# Altium project praline.PrjPcb (part 2 of 3)

## Sheet adc-dac.SchDoc
size 297 x 209 mm
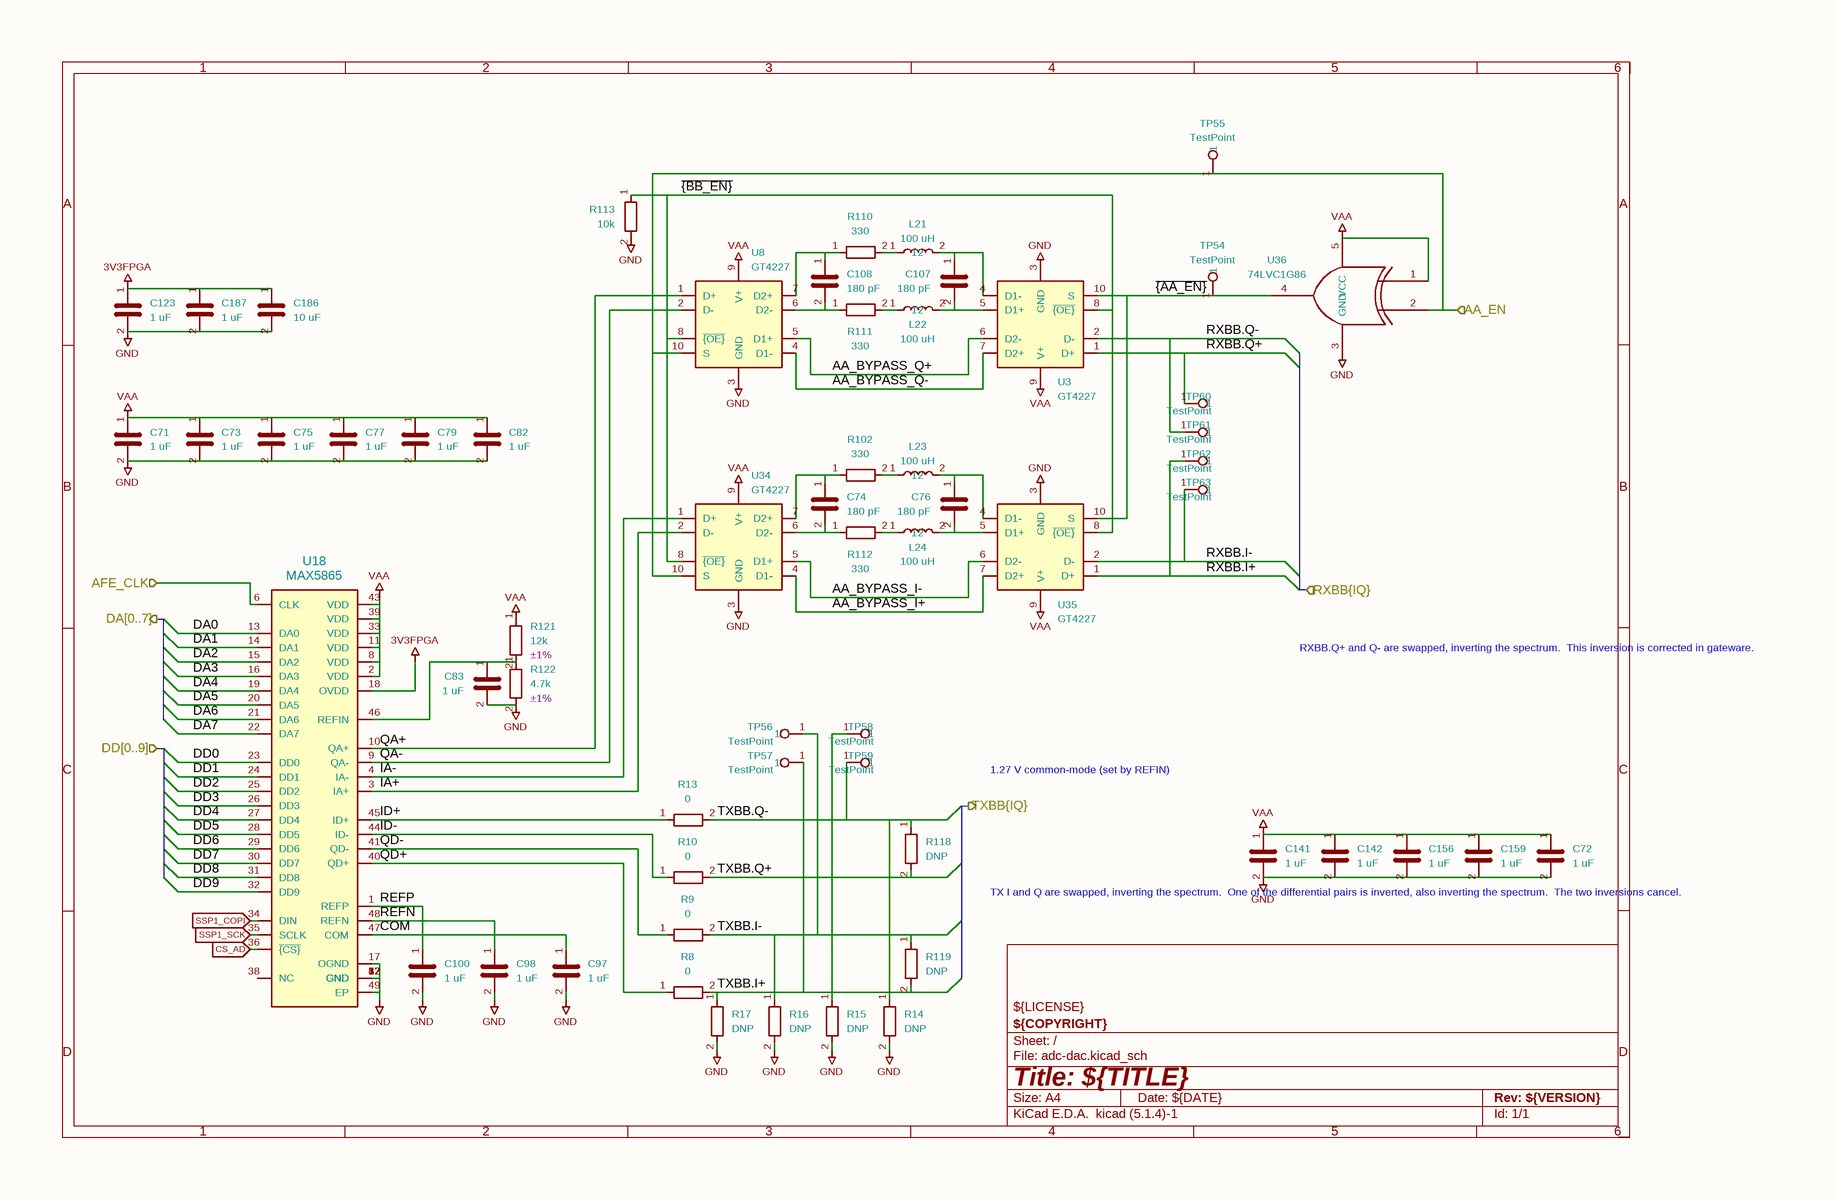
[diagram p5: adc-dac.SchDoc]

### Parts
C71  1 uF  [C_0201_0603Metric]
C72  1 uF  [C_0201_0603Metric]
C73  1 uF  [C_0201_0603Metric]
C74  180 pF  [C_0201_0603Metric]
C75  1 uF  [C_0201_0603Metric]
C76  180 pF  [C_0201_0603Metric]
C77  1 uF  [C_0201_0603Metric]
C79  1 uF  [C_0201_0603Metric]
C82  1 uF  [C_0201_0603Metric]
C83  1 uF  [C_0201_0603Metric]
C97  1 uF  [C_0201_0603Metric]
C98  1 uF  [C_0201_0603Metric]
C100  1 uF  [C_0201_0603Metric]
C107  180 pF  [C_0201_0603Metric]
C108  180 pF  [C_0201_0603Metric]
C123  1 uF  [C_0201_0603Metric]
C141  1 uF  [C_0201_0603Metric]
C142  1 uF  [C_0201_0603Metric]
C156  1 uF  [C_0201_0603Metric]
C159  1 uF  [C_0201_0603Metric]
C186  10 uF  [C_0805_2012Metric]
C187  1 uF  [C_0201_0603Metric]
L21  100 uH  [L_TDK_MLZ2012_h1.25mm]
L22  100 uH  [L_TDK_MLZ2012_h1.25mm]
L23  100 uH  [L_TDK_MLZ2012_h1.25mm]
L24  100 uH  [L_TDK_MLZ2012_h1.25mm]
R8  0  [R_0201_0603Metric]
R9  0  [R_0201_0603Metric]
R10  0  [R_0201_0603Metric]
R13  0  [R_0201_0603Metric]
R14  DNP  [R_0201_0603Metric]
R15  DNP  [R_0201_0603Metric]
R16  DNP  [R_0201_0603Metric]
R17  DNP  [R_0201_0603Metric]
R102  330  [R_0201_0603Metric]
R110  330  [R_0201_0603Metric]
R111  330  [R_0201_0603Metric]
R112  330  [R_0201_0603Metric]
R113  10k  [R_0402_1005Metric]
R118  DNP  [R_0201_0603Metric]
R119  DNP  [R_0201_0603Metric]
R121  Tolerance: ±1%  [R_0201_0603Metric]  (hidden comment: 12k)
R122  Tolerance: ±1%  [R_0201_0603Metric]  (hidden comment: 4.7k)
TP54  TestPoint  [TestPoint_Pad_D1.0mm]
TP55  TestPoint  [TestPoint_Pad_D1.0mm]
TP56  TestPoint  [TestPoint_Pad_D1.0mm]
TP57  TestPoint  [TestPoint_Pad_D1.0mm]
TP58  TestPoint  [TestPoint_Pad_D1.0mm]
TP59  TestPoint  [TestPoint_Pad_D1.0mm]
TP60  TestPoint  [TestPoint_Pad_D1.0mm]
TP61  TestPoint  [TestPoint_Pad_D1.0mm]
TP62  TestPoint  [TestPoint_Pad_D1.0mm]
TP63  TestPoint  [TestPoint_Pad_D1.0mm]
U3  GT4227  [GTIC_UQFN-10_1.4x1.8mm_P0.4mm]
U8  GT4227  [GTIC_UQFN-10_1.4x1.8mm_P0.4mm]
U18  MAX5865  [QFN-48-1EP_7x7mm_P0.5mm_EP5.3x5.3mm_ThermalVias]
U34  GT4227  [GTIC_UQFN-10_1.4x1.8mm_P0.4mm]
U35  GT4227  [GTIC_UQFN-10_1.4x1.8mm_P0.4mm]
U36  74LVC1G86  [SOT-353_SC-70-5]

### Ports
AA_EN (in), AFE_CLK (in), CS_AD (in), DA[0..7] (out), DD[0..9] (in), RXBB{IQ} (in), SSP1_COPI (in), SSP1_SCK (in), TXBB{IQ} (out)

### Nets
3V3FPGA: C123.1 C186.1 C187.1 U18.18(OVDD)
GND: C71.2 C72.2 C73.2 C75.2 C77.2 C79.2 C82.2 C83.2 C97.2 C98.2 C100.2 C123.2 C141.2 C142.2 C156.2 C159.2 C186.2 C187.2 R14.2 R15.2 R16.2 R17.2 R113.2 R122.2 U3.3(GND) U8.3(GND) U18.5(GND) U18.7(GND) U18.12(GND) U18.17(OGND) U18.37(GND) U18.42(GND) U18.49(EP) U34.3(GND) U35.3(GND) U36.3(GND)
VAA: C71.1 C72.1 C73.1 C75.1 C77.1 C79.1 C82.1 C141.1 C142.1 C156.1 C159.1 R121.1 U3.9(V+) U8.9(V+) U18.2(VDD) U18.8(VDD) U18.11(VDD) U18.33(VDD) U18.39(VDD) U18.43(VDD) U34.9(V+) U35.9(V+) U36.1 U36.5(VCC)
AA_BYPASS_I+: U34.4(D1-) U35.7(D2+)
AA_BYPASS_I-: U34.5(D1+) U35.6(D2-)
AA_BYPASS_Q+: U3.6(D2-) U8.5(D1+)
AA_BYPASS_Q-: U3.7(D2+) U8.4(D1-)
AA_EN: TP55.1 U8.10(S) U34.10(S) U36.2 ; port AA_EN
AFE_CLK: U18.6(CLK) ; port AFE_CLK
COM: C97.1 U18.47(COM)
CS_AD: U18.36(~{{CS}}) ; port CS_AD
DA0: U18.13(DA0)
DA1: U18.14(DA1)
DA2: U18.15(DA2)
DA3: U18.16(DA3)
DA4: U18.19(DA4)
DA5: U18.20(DA5)
DA6: U18.21(DA6)
DA7: U18.22(DA7)
DD0: U18.23(DD0)
DD1: U18.24(DD1)
DD2: U18.25(DD2)
DD3: U18.26(DD3)
DD4: U18.27(DD4)
DD5: U18.28(DD5)
DD6: U18.29(DD6)
DD7: U18.30(DD7)
DD8: U18.31(DD8)
DD9: U18.32(DD9)
IA+: U18.3(IA+) U34.2(D-)
IA-: U18.4(IA-) U34.1(D+)
ID+: R13.1 U18.45(ID+)
ID-: R10.1 U18.44(ID-)
QA+: U8.1(D+) U18.10(QA+)
QA-: U8.2(D-) U18.9(QA-)
QD+: R8.1 U18.40(QD+)
QD-: R9.1 U18.41(QD-)
REFN: C98.1 U18.48(REFN)
REFP: C100.1 U18.1(REFP)
RXBB.I+: TP62.1 U35.1(D+)
RXBB.I-: TP63.1 U35.2(D-)
RXBB.Q+: TP60.1 U3.1(D+)
RXBB.Q-: TP61.1 U3.2(D-)
SSP1_COPI: U18.34(DIN) ; port SSP1_COPI
SSP1_SCK: U18.35(SCLK) ; port SSP1_SCK
TXBB.I+: R8.2 R17.1 R119.2 TP57.1
TXBB.I-: R9.2 R16.1 R119.1 TP56.1
TXBB.Q+: R10.2 R15.1 R118.2 TP58.1
TXBB.Q-: R13.2 R14.1 R118.1 TP59.1
~{{AA_EN}}: TP54.1 U3.10(S) U35.10(S) U36.4
~{{BB_EN}}: R113.1 U3.8(~{{OE}}) U8.8(~{{OE}}) U34.8(~{{OE}}) U35.8(~{{OE}})
NetC74_1: C74.1 R102.1 U34.7(D2+)
NetC74_2: C74.2 R112.1 U34.6(D2-)
NetC76_1: C76.1 L23.2 U35.4(D1-)
NetC76_2: C76.2 L24.2 U35.5(D1+)
NetC83_1: C83.1 R121.2 R122.1 U18.46(REFIN)
NetC107_1: C107.1 L21.2 U3.4(D1-)
NetC107_2: C107.2 L22.2 U3.5(D1+)
NetC108_1: C108.1 R110.1 U8.7(D2+)
NetC108_2: C108.2 R111.1 U8.6(D2-)
NetL21_1: L21.1 R110.2
NetL22_1: L22.1 R111.2
NetL23_1: L23.1 R102.2
NetL24_1: L24.1 R112.2

Not connected (* = marked no-connect by the designer): U18 38(NC)

### Notes on the sheet
- RXBB.Q+ and Q- are swapped, inverting
  the spectrum.  This inversion is
  corrected in gateware.
- 1.27 V common-mode
  (set by REFIN)
- TX I and Q are swapped, inverting the
  spectrum.  One of the differential pairs
  is inverted, also inverting the
  spectrum.  The two inversions cancel.
- 1
- 2
- 3
- 4
- 5
- 6
- A
- B
- C
- ${LICENSE}
- D
- Title: ${TITLE}
- File: adc-dac.kicad_sch
- Sheet: /
- ${COPYRIGHT}
- KiCad E.D.A.  kicad (5.1.4)-1
- Size: A4
- Date: ${DATE}
- Rev: ${VERSION}
- Id: 1/1

### Library data of the parts
C71-C73 C75 C77 C79 C82 C83 C97 C98 C100 C123 C141 C142 C156 C159 C187 = C: as C17 on sheet baseband; Value: 1 uF; Footprint: Capacitor_SMD:C_0201_0603Metric
C74 C76 C107 C108 = C: Manufacturer: Murata; Part Number: GRM0335C1H181JA01D; Description: CAP CER 180PF 50V C0G/NP0 0201; Substitution: GRM0335C1H181*; Value: 180 pF; Footprint: Capacitor_SMD:C_0201_0603Metric
C186 = C: as C200 on sheet frontend; Value: 10 uF; Footprint: Capacitor_SMD:C_0805_2012Metric
L21-L24 = L: as L4 on sheet frontend; Value: 100 uH; Footprint: praline:L_TDK_MLZ2012_h1.25mm
R8-R10 R13 = R: as R149 on sheet baseband; Value: 0; Footprint: Resistor_SMD:R_0201_0603Metric
R14-R17 R118 R119 = R: Value: DNP; Footprint: Resistor_SMD:R_0201_0603Metric
R102 R110-R112 = R: Manufacturer: Yageo; Part Number: RC0201JR-07330RL; Description: RES 330 OHM 5% 1/20W 0201; Substitution: any equivalent; Value: 330; Footprint: Resistor_SMD:R_0201_0603Metric
R113 = R: as R7 on sheet mcu; Value: 10k; Footprint: Resistor_SMD:R_0402_1005Metric
R121 = R: Manufacturer: Yageo; Part Number: RC0201FR-0712KL; Description: RES 12K OHM 1% 1/20W 0201; Substitution: any equivalent; Value: 12k; Footprint: Resistor_SMD:R_0201_0603Metric
R122 = R: as R74 on sheet mcu; Value: 4.7k; Footprint: Resistor_SMD:R_0201_0603Metric
U3 U8 U34 U35 = GT4227QA: Manufacturer: GTIC; Description: USB 2.0 Switch with ESD Protection, UQFN-10 Pitch 0.4 mm; Part Number: GT4227QA; Value: GT4227; Footprint: praline:GTIC_UQFN-10_1.4x1.8mm_P0.4mm
U18 = MAX5864: Manufacturer: Maxim; Part Number: MAX5865ETM+T; Description: IC ANLG FRONT END 40MSPS 48-TQFN; Substitution: MAX5865ETM+; Value: MAX5865; Footprint: praline:QFN-48-1EP_7x7mm_P0.5mm_EP5.3x5.3mm_ThermalVias
U36 = 74LVC1G86: as U13 on sheet frontend; Value: 74LVC1G86; Footprint: Package_TO_SOT_SMD:SOT-353_SC-70-5
TP54-TP63 = TestPoint: Value: TestPoint; Footprint: TestPoint:TestPoint_Pad_D1.0mm

## Sheet power.SchDoc
size 297 x 209 mm
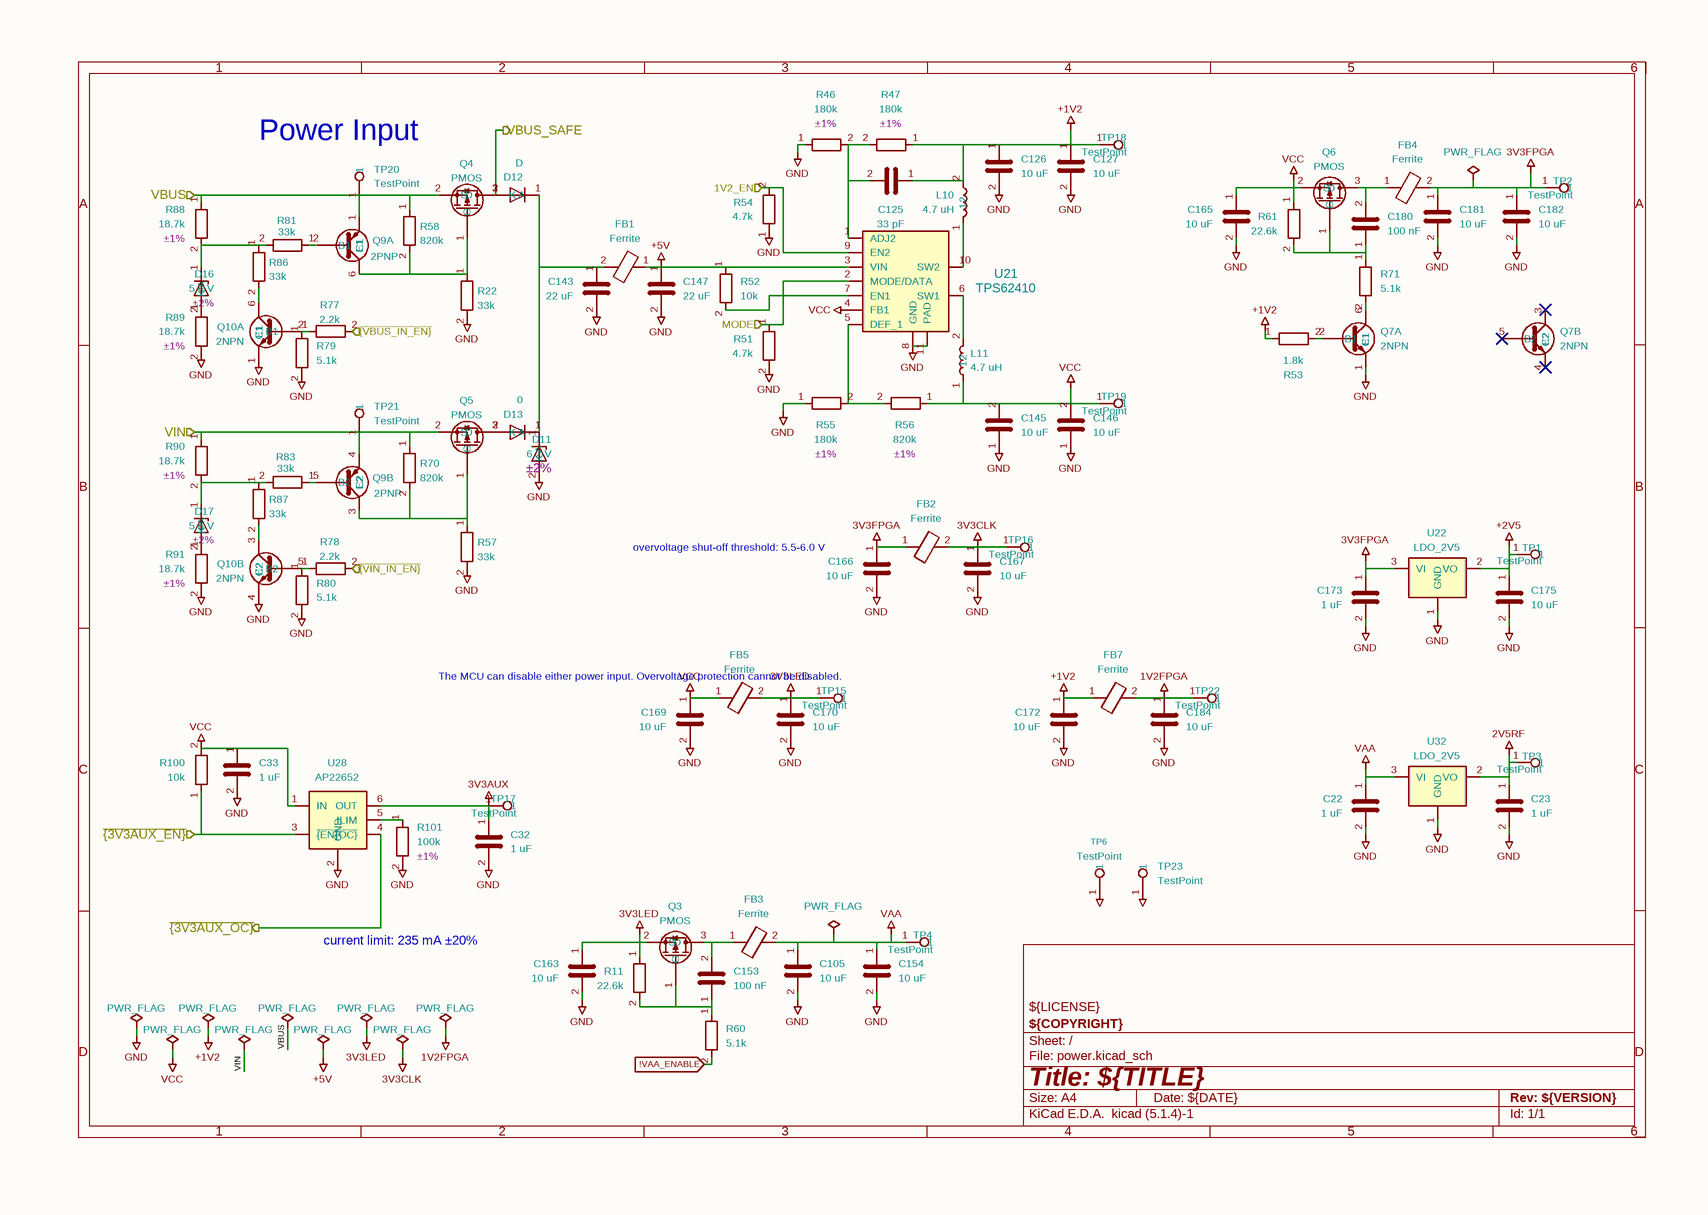
[diagram p6: power.SchDoc]

### Parts
#FLG01  PWR_FLAG  (graphical)
#FLG02  PWR_FLAG  (graphical)
#FLG03  PWR_FLAG  (graphical)
#FLG04  PWR_FLAG  (graphical)
#FLG05  PWR_FLAG  (graphical)
#FLG06  PWR_FLAG  (graphical)
#FLG08  PWR_FLAG  (graphical)
#FLG09  PWR_FLAG  (graphical)
#FLG012  PWR_FLAG  (graphical)
#FLG013  PWR_FLAG  (graphical)
#FLG014  PWR_FLAG  (graphical)
C22  1 uF  [C_0402_1005Metric]
C23  1 uF  [C_0402_1005Metric]
C32  1 uF  [C_0402_1005Metric]
C33  1 uF  [C_0402_1005Metric]
C105  10 uF  [C_0805_2012Metric]
C125  33 pF  [C_0201_0603Metric]
C126  10 uF  [C_0805_2012Metric]
C127  10 uF  [C_0805_2012Metric]
C143  22 uF  [C_0805_2012Metric]
C145  10 uF  [C_0805_2012Metric]
C146  10 uF  [C_0805_2012Metric]
C147  22 uF  [C_0805_2012Metric]
C153  100 nF  [C_0402_1005Metric]
C154  10 uF  [C_0805_2012Metric]
C163  10 uF  [C_0805_2012Metric]
C165  10 uF  [C_0805_2012Metric]
C166  10 uF  [C_0805_2012Metric]
C167  10 uF  [C_0805_2012Metric]
C169  10 uF  [C_0805_2012Metric]
C170  10 uF  [C_0805_2012Metric]
C172  10 uF  [C_0805_2012Metric]
C173  1 uF  [C_0402_1005Metric]
C175  10 uF  [C_0805_2012Metric]
C180  100 nF  [C_0402_1005Metric]
C181  10 uF  [C_0805_2012Metric]
C182  10 uF  [C_0805_2012Metric]
C184  10 uF  [C_0805_2012Metric]
D11  Tolerance: ±2%  [TSLP-2-19]  (hidden comment: 6.2 V)
D12  D  [D_SOD-123FL]
D13  0  [TSLP-2-19]
D16  Tolerance: ±2%  [TSLP-2-19]  (hidden comment: 5.6 V)
D17  Tolerance: ±2%  [TSLP-2-19]  (hidden comment: 5.6 V)
FB1  Ferrite  [L_0603_1608Metric]
FB2  Ferrite  [L_0603_1608Metric]
FB3  Ferrite  [L_0603_1608Metric]
FB4  Ferrite  [L_0603_1608Metric]
FB5  Ferrite  [L_0603_1608Metric]
FB7  Ferrite  [L_0603_1608Metric]
L10  4.7 uH  [L_Taiyo-Yuden_NR-40xx]
L11  4.7 uH  [L_Taiyo-Yuden_NR-40xx]
Q3  PMOS  [SOT-23-3]
Q4  PMOS  [SOT-23-3]
Q5  PMOS  [SOT-23-3]
Q6  PMOS  [SOT-23-3]
Q7  2NPN  [SOT-363_SC-70-6]  (parts A,B of 2)
Q9  2PNP  [SOT-363_SC-70-6]  (parts A,B of 2)
Q10  2NPN  [SOT-363_SC-70-6]  (parts A,B of 2)
R11  22.6k  [R_0201_0603Metric]
R22  33k  [R_0201_0603Metric]
R46  Tolerance: ±1%  [R_0402_1005Metric]  (hidden comment: 180k)
R47  Tolerance: ±1%  [R_0402_1005Metric]  (hidden comment: 180k)
R51  4.7k  [R_0201_0603Metric]
R52  10k  [R_0402_1005Metric]
R53  1.8k  [R_0402_1005Metric]
R54  4.7k  [R_0201_0603Metric]
R55  Tolerance: ±1%  [R_0402_1005Metric]  (hidden comment: 180k)
R56  Tolerance: ±1%  [R_0402_1005Metric]  (hidden comment: 820k)
R57  33k  [R_0201_0603Metric]
R58  820k  [R_0402_1005Metric]
R60  5.1k  [R_0402_1005Metric]
R61  22.6k  [R_0201_0603Metric]
R70  820k  [R_0402_1005Metric]
R71  5.1k  [R_0402_1005Metric]
R77  2.2k  [R_0201_0603Metric]
R78  2.2k  [R_0201_0603Metric]
R79  5.1k  [R_0402_1005Metric]
R80  5.1k  [R_0402_1005Metric]
R81  33k  [R_0201_0603Metric]
R83  33k  [R_0201_0603Metric]
R86  33k  [R_0201_0603Metric]
R87  33k  [R_0201_0603Metric]
R88  Tolerance: ±1%  [R_0402_1005Metric]  (hidden comment: 18.7k)
R89  Tolerance: ±1%  [R_0402_1005Metric]  (hidden comment: 18.7k)
R90  Tolerance: ±1%  [R_0402_1005Metric]  (hidden comment: 18.7k)
R91  Tolerance: ±1%  [R_0402_1005Metric]  (hidden comment: 18.7k)
R100  10k  [R_0402_1005Metric]
R101  Tolerance: ±1%  [R_0402_1005Metric]  (hidden comment: 100k)
TP1  TestPoint  [TestPoint_Pad_D1.0mm]
TP2  TestPoint  [TestPoint_Pad_D1.0mm]
TP3  TestPoint  [TestPoint_Pad_D1.0mm]
TP4  TestPoint  [TestPoint_Pad_D1.0mm]
TP6  TestPoint  [TestPoint_Loop_D1.80mm_Drill1.0mm_Beaded]
TP15  TestPoint  [TestPoint_Pad_D1.0mm]
TP16  TestPoint  [TestPoint_Pad_D1.0mm]
TP17  TestPoint  [TestPoint_Pad_D1.0mm]
TP18  TestPoint  [TestPoint_Pad_D1.0mm]
TP19  TestPoint  [TestPoint_Pad_D1.0mm]
TP20  TestPoint  [TestPoint_Pad_D1.0mm]
TP21  TestPoint  [TestPoint_Pad_D1.0mm]
TP22  TestPoint  [TestPoint_Pad_D1.0mm]
TP23  TestPoint  [TestPoint_Pad_D1.0mm]
U21  TPS62410  [Texas_S-PVSON-N10_ThermalVias]
U22  LDO_2V5  [SOT-23-3]
U28  AP22652  [TSOP-6_1.65x3.05mm_P0.95mm]
U32  LDO_2V5  [SOT-23-3]

### Ports
1V2_EN (in), !VAA_ENABLE (in), MODE (in), VBUS (in), VBUS_SAFE (out), VIN (in), ~{{3V3AUX_EN}} (in), ~{{3V3AUX_OC}} (out), ~{{VBUS_IN_EN}} (in), ~{{VIN_IN_EN}} (in)

### Nets
1V2FPGA: #FLG012.1 C184.1 FB7.2 TP22.1
2V5RF: C23.1 TP3.1 U32.2(VO)
3V3AUX: C32.1 TP17.1 U28.6(OUT)
3V3CLK: #FLG014.1 C167.1 FB2.2 TP16.1
3V3FPGA: #FLG02.1 C166.1 C173.1 C181.1 C182.1 FB2.1 FB4.2 TP2.1 U22.3(VI)
3V3LED: #FLG013.1 C163.1 C170.1 FB5.2 Q3.2(S) R11.1 TP15.1
+1V2: #FLG05.1 C125.1 C126.1 C127.1 C172.1 FB7.1 L10.2 R47.1 R53.1 TP18.1
+2V5: C175.1 TP1.1 U22.2(VO)
+5V: #FLG09.1 C147.1 FB1.1 R52.1 U21.3(VIN)
GND: #FLG01.1 C22.2 C23.2 C32.2 C33.2 C105.2 C126.2 C127.2 C143.2 C145.1 C146.1 C147.2 C154.2 C163.2 C165.2 C166.2 C167.2 C169.2 C170.2 C172.2 C173.2 C175.2 C181.2 C182.2 C184.2 D11.2(A) Q7.1(E1) Q10.1(E1) Q10.4(E2) R22.2 R46.1 R51.2 R54.1 R55.1 R57.2 R79.2 R80.2 R89.2 R91.2 R101.2 TP6.1 TP23.1 U21.8(GND) U21.11(PAD) U22.1(GND) U28.2(GND) U32.1(GND)
VAA: #FLG03.1 C22.1 C105.1 C154.1 FB3.2 TP4.1 U32.3(VI)
VCC: #FLG04.1 C33.1 C145.2 C146.2 C165.1 C169.1 FB5.1 L11.1 Q6.2(S) R56.1 R61.1 R100.2 TP19.1 U21.4(FB1) U28.1(IN)
1V2_EN: R54.2 U21.9(EN2) ; port 1V2_EN
!VAA_ENABLE: R60.2 ; port !VAA_ENABLE
MODE: R51.1 U21.2(MODE/DATA) ; port MODE
VBUS: Q4.2(S) Q9.1(E1) R58.1 R88.1 TP20.1 ; port VBUS
VBUS: #FLG08.1  [a separate net that carries the same name]
VBUS_SAFE: D12.2(A) Q4.3(D) ; port VBUS_SAFE
VIN: Q5.2(S) Q9.4(E2) R70.1 R90.1 TP21.1 ; port VIN
VIN: #FLG06.1  [a separate net that carries the same name]
~{{3V3AUX_EN}}: R100.1 U28.3(~{{EN}}) ; port ~{{3V3AUX_EN}}
~{{3V3AUX_OC}}: U28.4(~{{OC}}) ; port ~{{3V3AUX_OC}}
~{{VBUS_IN_EN}}: R77.2 ; port ~{{VBUS_IN_EN}}
~{{VIN_IN_EN}}: R78.2 ; port ~{{VIN_IN_EN}}
NetC125_2: C125.2 R46.2 R47.2 U21.1(ADJ2)
NetC143_1: C143.1 D11.1(K) D12.1(K) D13.1(K) FB1.2
NetC153_1: C153.1 Q3.1(G) R11.2 R60.1
NetC153_2: C153.2 FB3.1 Q3.3(D)
NetC180_1: C180.1 Q6.1(G) R61.2 R71.1
NetC180_2: C180.2 FB4.1 Q6.3(D)
NetD13_2: D13.2(A) Q5.3(D)
NetD16_1: D16.1(K) R81.2 R86.1 R88.2
NetD16_2: D16.2(A) R89.1
NetD17_1: D17.1(K) R83.2 R87.1 R90.2
NetD17_2: D17.2(A) R91.1
NetL10_1: L10.1 U21.10(SW2)
NetL11_2: L11.2 U21.6(SW1)
NetQ4_1: Q4.1(G) Q9.6(C1) R22.1 R58.2
NetQ5_1: Q5.1(G) Q9.3(C2) R57.1 R70.2
NetQ7_2: Q7.2(B1) R53.2
NetQ7_6: Q7.6(C1) R71.2
NetQ9_2: Q9.2(B1) R81.1
NetQ9_5: Q9.5(B2) R83.1
NetQ10_2: Q10.2(B1) R77.1 R79.1
NetQ10_3: Q10.3(C2) R87.2
NetQ10_5: Q10.5(B2) R78.1 R80.1
NetQ10_6: Q10.6(C1) R86.2
NetR52_2: R52.2 U21.7(EN1)
NetR55_2: R55.2 R56.2 U21.5(DEF_1)
NetR101_1: R101.1 U28.5(ILIM)

Not connected (* = marked no-connect by the designer): Q7 3(C2)* 4(E2)* 5(B2)*

### Notes on the sheet
- (near TP20) Power Input
- (near C166) overvoltage shut-off
  threshold: 5.5-6.0 V
- The MCU can disable either power input.
  Overvoltage protection cannot be disabled.
- current limit: 235 mA ±20%
- 1
- 2
- 3
- 4
- 5
- 6
- A
- B
- C
- ${LICENSE}
- D
- Title: ${TITLE}
- File: power.kicad_sch
- Sheet: /
- ${COPYRIGHT}
- KiCad E.D.A.  kicad (5.1.4)-1
- Size: A4
- Date: ${DATE}
- Rev: ${VERSION}
- Id: 1/1

### Library data of the parts
#FLG01 #FLG02 #FLG03 #FLG04 #FLG05 #FLG06 #FLG08 #FLG09 #FLG012 #FLG013 #FLG014 = PWR_FLAG: Description: Special symbol for telling ERC where power comes from; Value: PWR_FLAG
C22 C23 C173 = C: Part Number: CL05A105KA5NQNC; Manufacturer: Samsung; Description: CAP CER 1UF 25V X5R 0402; Substitution: Murata GRM155R61E105KA12D; Value: 1 uF; Footprint: Capacitor_SMD:C_0402_1005Metric
C32 C33 = C: Manufacturer: Samsung; Part Number: CL05A105KA5NQNC; Description: CAP CER 1UF 25V X5R 0402; Substitution: Murata GRM155R61E105KA12D; Value: 1 uF; Footprint: Capacitor_SMD:C_0402_1005Metric
C105 C126 C127 C145 C146 C154 C163 C165-C167 C169 C170 C172 C175 C181 C182 C184 = C: Manufacturer: Samsung; Part Number: CL21A106KOQNNNE; Description: CAP CER 10UF 16V X5R 0805; Substitution: Murata GRM21BR61A106KE19L; Value: 10 uF; Footprint: Capacitor_SMD:C_0805_2012Metric
C125 = C: Manufacturer: Murata; Part Number: GRM0335C1H330JA01D; Description: CAP CER 33PF 50V C0G/NP0 0201; Substitution: GRM0335C1H330*, GRM0335C1E330*; Value: 33 pF; Footprint: Capacitor_SMD:C_0201_0603Metric
C143 C147 = C: Manufacturer: Samsung; Part Number: CL21A226MAYNNNE; Description: CAP CER 22UF 25V X5R 0805; Substitution: Murata GRM21BR61A106KE19L; Value: 22 uF; Footprint: Capacitor_SMD:C_0805_2012Metric
C153 C180 = C: Manufacturer: Samsung; Part Number: CL05A104KA5NNNC; Description: CAP CER 0.1UF 25V X5R 0402; Substitution: Murata GRM155R61A104KA01D; Value: 100 nF; Footprint: Capacitor_SMD:C_0402_1005Metric
D11 = D_Zener: Manufacturer: Nexperia; Part Number: BZX884-B6V2,315; Description: DIODE ZENER 6.2V 250MW DFN1006-2; Value: 6.2 V; Footprint: praline:TSLP-2-19
D12 = D: Manufacturer: Yangzhou Yangjie; Part Number: U1D; Description: SOD-123FL 200V 1.0A  Diodes Rec; Value: D; Footprint: praline:D_SOD-123FL
D13 = D: Manufacturer: Yageo; Part Number: RC0201JR-070RL; Description: RES 0 OHM JUMPER 1/20W 0201; Value: 0; Footprint: praline:TSLP-2-19
D16 D17 = D_Zener: Manufacturer: Nexperia; Part Number: BZX884-B5V6,315; Description: DIODE ZENER 5.6V 250MW DFN1006-2; Value: 5.6 V; Footprint: praline:TSLP-2-19
FB1-FB5 FB7 = FerriteBead: Manufacturer: TAI-TECH; Part Number: HCB1608KF-102T10; Description: 1kΩ@100MHz 200mΩ ±25% 0603 Ferrite Bead; Substitution: Murata BLM18KG102SN1*; Value: Ferrite; Footprint: Inductor_SMD:L_0603_1608Metric
L10 L11 = L: Manufacturer: Taiyo Yuden; Part Number: LSXND4040TKL4R7MDG; Description: FIXED IND 4.7UH 1.7A 84 MOHM SMD; Substitution: NRS4018T4R7MDGJ, LLXND4040TKL4R7MDG, NRS4018T4R7MDGJ; Value: 4.7 uH; Footprint: Inductor_SMD:L_Taiyo-Yuden_NR-40xx
Q3-Q6 = Q_PMOS_GSD: Manufacturer: Yangzhou Yangjie; Part Number: YJL3401A; Description: P-CH MOSFET 30V 4.4A SOT-23-3L; Substitution: Alpha & Omega AO3401A; Value: PMOS; Footprint: Package_TO_SOT_SMD:SOT-23-3
Q7 Q10 = BC847BS: Manufacturer: Yangzhou Yangjie; Description: SOT-363 NPN+NPN 0.3W 0.1A 50V; Part Number: BC847BS; Value: 2NPN; Footprint: Package_TO_SOT_SMD:SOT-363_SC-70-6
Q9 = Q_Dual_PNP_PNP_E1B1C2E2B2C1: Manufacturer: Yangzhou Yangjie; Part Number: BC857BS; Description: PNP+PNP TRANS 45V 0.2A SOT-363; Value: 2PNP; Footprint: Package_TO_SOT_SMD:SOT-363_SC-70-6
R11 R61 = R: Manufacturer: Yageo; Part Number: RC0201FR-0722K6L; Description: RES 22.6K OHM 1% 1/20W 0201; Substitution: any equivalent; Value: 22.6k; Footprint: Resistor_SMD:R_0201_0603Metric
R22 R57 R86 R87 = R: Manufacturer: Yageo; Part Number: RC0201JR-0733KL; Description: RES 33K OHM 5% 1/20W 0201; Substitution: any equivalent; Value: 33k; Footprint: Resistor_SMD:R_0201_0603Metric
R46 R47 R55 = R: Manufacturer: Yageo; Part Number: RC0402FR-07180KL; Description: RES 180K OHM 1% 1/16W 0402; Substitution: any equivalent; Value: 180k; Footprint: Resistor_SMD:R_0402_1005Metric
R51 R54 = R: Manufacturer: Yageo; Part Number: RC0201FR-074K7L; Description: RES 4.7K OHM 1% 1/20W 0201; Substitution: any equivalent; Value: 4.7k; Footprint: Resistor_SMD:R_0201_0603Metric
R52 R100 = R: Manufacturer: Yageo; Part Number: RC0402JR-0710KL; Description: RES 10K OHM 1/16W 5% 0402 SMD; Substitution: any equivalent; Value: 10k; Footprint: Resistor_SMD:R_0402_1005Metric
R53 = R: Manufacturer: Yageo; Part Number: RC0402JR-071K8L; Description: RES 1.8K OHM 5% 1/16W 0402; Substitution: any equivalent; Value: 1.8k; Footprint: Resistor_SMD:R_0402_1005Metric
R56 = R: Manufacturer: Yageo; Part Number: RC0402FR-07820KL; Description: RES 820K OHM 1% 1/16W 0402; Substitution: any equivalent; Value: 820k; Footprint: Resistor_SMD:R_0402_1005Metric
R58 R70 = R: Part Number: RC0402FR-07820KL; Manufacturer: Yageo; Description: RES 820K OHM 1% 1/16W 0402; Substitution: any equivalent; Value: 820k; Footprint: Resistor_SMD:R_0402_1005Metric
R60 R71 R79 R80 = R: Part Number: RC0402JR-075K1L; Manufacturer: Yageo; Description: RES 5.1K OHM 5% 1/16W 0402; Substitution: any equivalent; Value: 5.1k; Footprint: Resistor_SMD:R_0402_1005Metric
R77 R78 = R: Part Number: RC0201JR-072K2L; Manufacturer: Yageo; Description: RES 2.2K OHM 5% 1/20W 0201; Substitution: any equivalent; Value: 2.2k; Footprint: Resistor_SMD:R_0201_0603Metric
R81 R83 = R: Part Number: RC0201JR-0733KL; Manufacturer: Yageo; Description: RES 33K OHM 5% 1/20W 0201; Substitution: any equivalent; Value: 33k; Footprint: Resistor_SMD:R_0201_0603Metric
R88-R91 = R: Manufacturer: Yageo; Part Number: RC0402FR-0718K7L; Description: RES 18.7K OHM 1% 1/16W 0402; Substitution: any equivalent; Value: 18.7k; Footprint: Resistor_SMD:R_0402_1005Metric
R101 = R: Manufacturer: Yageo; Part Number: RC0402FR-07100KL; Description: RES 100K OHM 1% 1/16W 0402; Substitution: any equivalent; Value: 100k; Footprint: Resistor_SMD:R_0402_1005Metric
TP6 = TestPoint: Manufacturer: Ronghe; Part Number: RH-5001; Description: PC TEST POINT MINIATURE BLACK; Value: TestPoint; Footprint: TestPoint:TestPoint_Loop_D1.80mm_Drill1.0mm_Beaded
U21 = TPS62410: Manufacturer: Texas Instruments; Part Number: TPS62410DRCR; Description: IC BUCK SYNC DUAL ADJ 0.8A 10SON; Value: TPS62410; Footprint: praline:Texas_S-PVSON-N10_ThermalVias
U22 U32 = XC6206PxxxMR: Manufacturer: UMW; Part Number: XC6206P252MR; Description: Linear Voltage Regulator IC Positive Fixed 1 Output 100mA SOT-23; Value: LDO_2V5; Footprint: Package_TO_SOT_SMD:SOT-23-3
U28 = BD2243G: Manufacturer: Diodes Inc.; Part Number: AP22652W6-7; Description: LOAD SWITCH,SOT26,T&R,3K; Value: AP22652; Footprint: Package_SO:TSOP-6_1.65x3.05mm_P0.95mm
TP1-TP4 TP15-TP23 = TestPoint: Value: TestPoint; Footprint: TestPoint:TestPoint_Pad_D1.0mm

## Sheet usb.SchDoc
size 297 x 209 mm
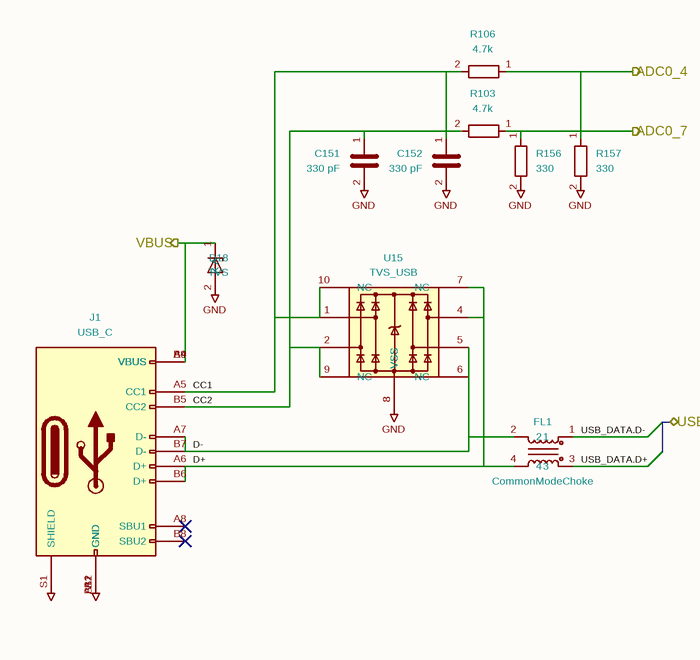
[diagram p7: usb.SchDoc]

### Parts
C151  330 pF  [C_0201_0603Metric]
C152  330 pF  [C_0201_0603Metric]
D18  TVS  [TSLP-2-19]
FL1  CommonModeChoke  [L_CommonModeChoke_Murata_DLM0NS]
J1  USB_C  [USB_C_Receptacle_HRO_TYPE-C-31-M-12]
R103  4.7k  [R_0201_0603Metric]
R106  4.7k  [R_0201_0603Metric]
R156  330  [R_0201_0603Metric]
R157  330  [R_0201_0603Metric]
U15  TVS_USB  [Diodes_UDFN-10_1.0x2.5mm_P0.5mm]

### Ports
ADC0_4 (out), ADC0_7 (out), USB_DATA{USB2} (bidir), VBUS (out)

### Nets
GND: C151.2 C152.2 D18.2(A) J1.A1(GND) J1.A12(GND) J1.B1(GND) J1.B12(GND) J1.S1(SHIELD) R156.2 R157.2 U15.3(VSS) U15.8(VSS)
ADC0_4: R106.1 R157.1 ; port ADC0_4
ADC0_7: R103.1 R156.1 ; port ADC0_7
CC1: C152.1 J1.A5(CC1) R106.2 U15.1 U15.10(NC)
CC2: C151.1 J1.B5(CC2) R103.2 U15.2 U15.9(NC)
D+: FL1.4 J1.A6(D+) J1.B6(D+) U15.4 U15.7(NC)
D-: FL1.2 J1.A7(D-) J1.B7(D-) U15.5 U15.6(NC)
USB_DATA.D+: FL1.3
USB_DATA.D-: FL1.1
VBUS: D18.1(K) J1.A4(VBUS) J1.A9(VBUS) J1.B4(VBUS) J1.B9(VBUS) ; port VBUS

Not connected (* = marked no-connect by the designer): J1 A8(SBU1)* B8(SBU2)*

### Notes on the sheet
- 1
- 2
- 3
- 4
- 5
- 6
- A
- B
- C
- ${LICENSE}
- D
- Title: ${TITLE}
- File: usb.kicad_sch
- Sheet: /
- ${COPYRIGHT}
- KiCad E.D.A.  kicad (5.1.4)-1
- Size: A4
- Date: ${DATE}
- Rev: ${VERSION}
- Id: 1/1

### Library data of the parts
C151 C152 = C: Part Number: GRM0335C1E331JA01D; Manufacturer: Murata; Description: CAP CER 330PF 25V C0G/NP0 0201; Substitution: GRM0335C1E331*, GRM0335C1H331*; Value: 330 pF; Footprint: Capacitor_SMD:C_0201_0603Metric
D18 = D_Zener: Manufacturer: MDD; Part Number: ESD8D12V; Description: TVS DIODE 12V UNIDIRECTIONAL DFN1006; Value: TVS; Footprint: praline:TSLP-2-19
FL1 = Filter_EMI_CommonMode: Manufacturer: Murata; Part Number: DLM0NSB280HY2D; Description: CMC 130MA 2LN 28 OHM SMD; Value: CommonModeChoke; Footprint: praline:L_CommonModeChoke_Murata_DLM0NS
J1 = USB_C_Receptacle_USB2.0_16P: Manufacturer: DEALON; Part Number: USB-TYPE-C-019; Description: CONN RCPT USB2.0 TYPE-C 16POS; Substitution: Yuandi TYPE-611A-T3; Value: USB_C; Footprint: praline:USB_C_Receptacle_HRO_TYPE-C-31-M-12
R103 R106 = R: as R51 on sheet power; Value: 4.7k; Footprint: Resistor_SMD:R_0201_0603Metric
R156 R157 = R: Manufacturer: Yageo; Part Number: RC0201JR-07330RL; Description: RES 330 OHM 5% 1/20W 0201; Substitution: any equivalent; Value: 330; Footprint: Resistor_SMD:R_0201_0603Metric
U15 = D3V3XA4B10LP: Manufacturer: TECH PUBLIC; Part Number: TPAZ1143-04F; Description: 4-Channel Low Capacitance TVS Diode Array, DFN-10; Value: TVS_USB; Footprint: Package_DFN_QFN:Diodes_UDFN-10_1.0x2.5mm_P0.5mm

## Sheet mixer.SchDoc
size 297 x 209 mm
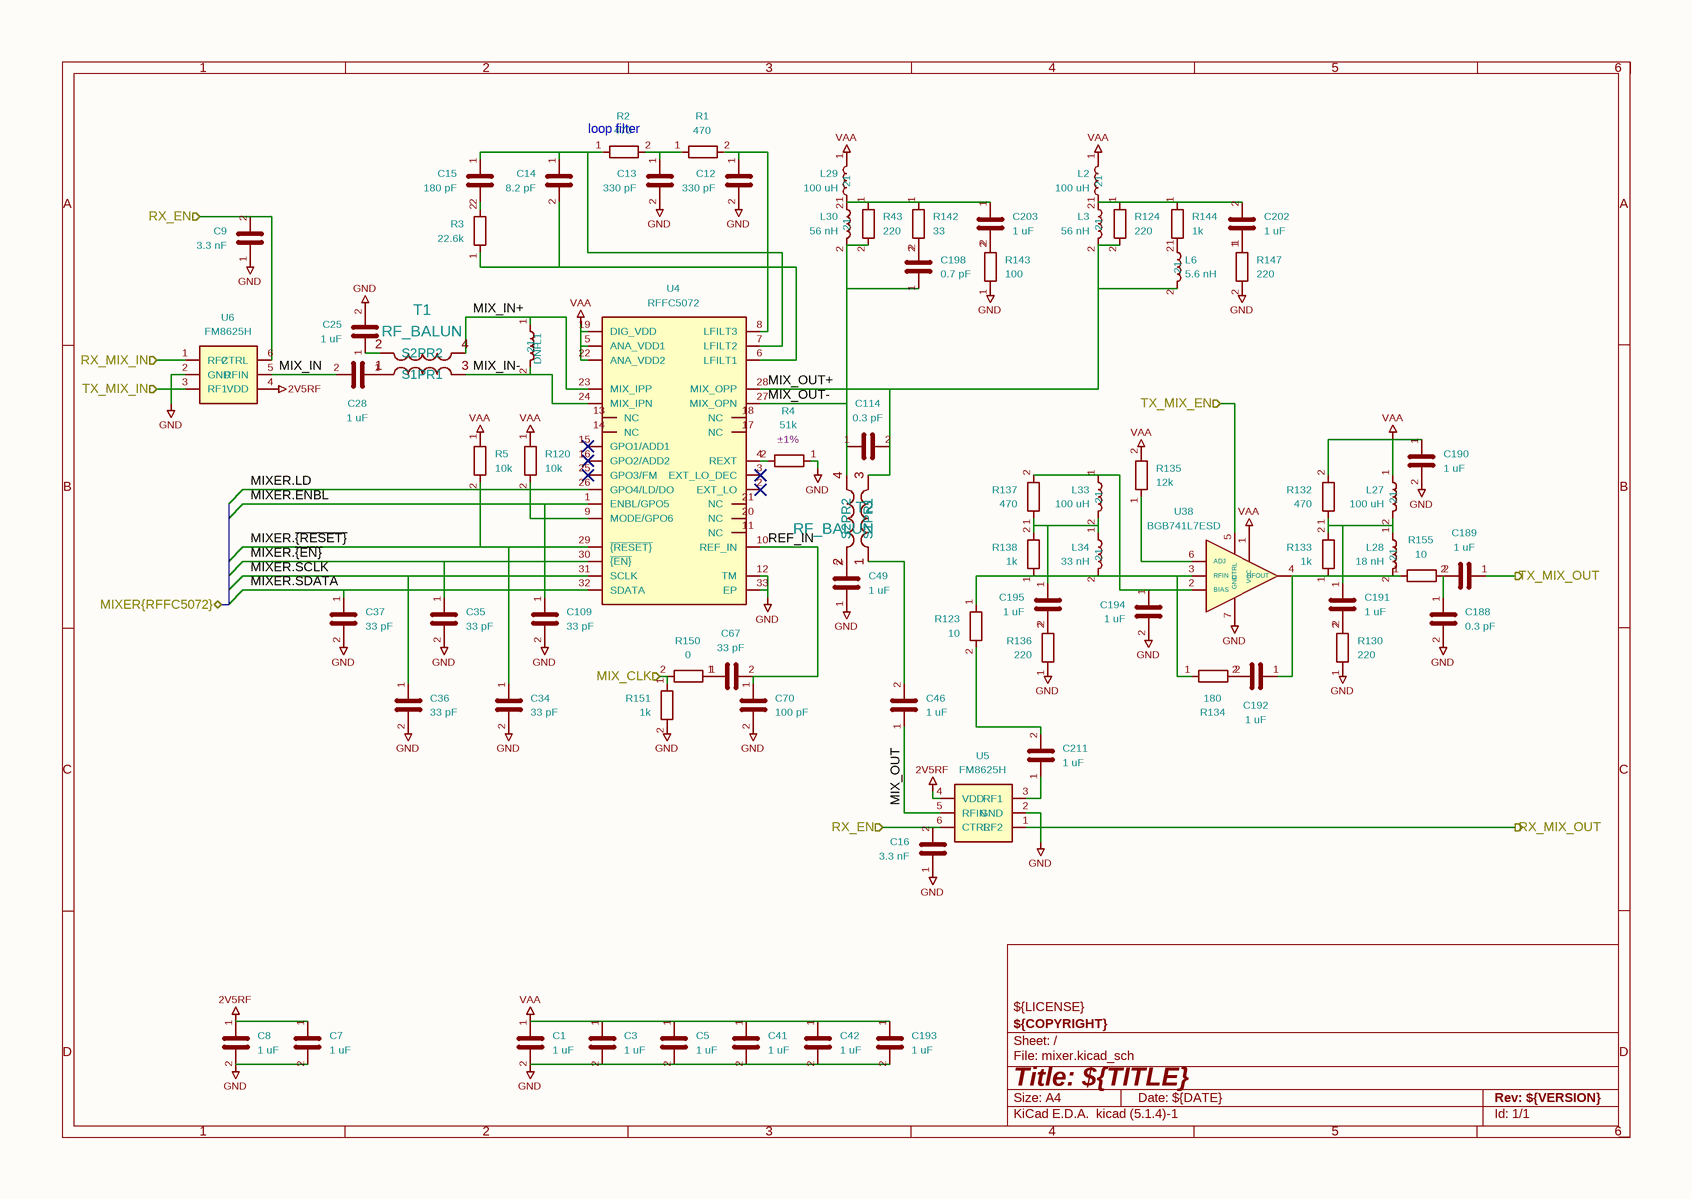
[diagram p8: mixer.SchDoc]

### Parts
C1  1 uF  [C_0201_0603Metric]
C3  1 uF  [C_0201_0603Metric]
C5  1 uF  [C_0201_0603Metric]
C7  1 uF  [C_0201_0603Metric]
C8  1 uF  [C_0201_0603Metric]
C9  3.3 nF  [C_0201_0603Metric]
C12  330 pF  [C_0201_0603Metric]
C13  330 pF  [C_0201_0603Metric]
C14  8.2 pF  [C_0201_0603Metric]
C15  180 pF  [C_0201_0603Metric]
C16  3.3 nF  [C_0201_0603Metric]
C25  1 uF  [C_0201_0603Metric]
C28  1 uF  [C_0201_0603Metric]
C34  33 pF  [C_0201_0603Metric]
C35  33 pF  [C_0201_0603Metric]
C36  33 pF  [C_0201_0603Metric]
C37  33 pF  [C_0201_0603Metric]
C41  1 uF  [C_0201_0603Metric]
C42  1 uF  [C_0201_0603Metric]
C46  1 uF  [C_0201_0603Metric]
C49  1 uF  [C_0201_0603Metric]
C67  33 pF  [C_0201_0603Metric]
C70  100 pF  [C_0201_0603Metric]
C109  33 pF  [C_0201_0603Metric]
C114  0.3 pF  [C_0201_0603Metric]
C188  0.3 pF  [C_0201_0603Metric]
C189  1 uF  [C_0201_0603Metric]
C190  1 uF  [C_0201_0603Metric]
C191  1 uF  [C_0201_0603Metric]
C192  1 uF  [C_0201_0603Metric]
C193  1 uF  [C_0201_0603Metric]
C194  1 uF  [C_0201_0603Metric]
C195  1 uF  [C_0201_0603Metric]
C198  0.7 pF  [C_0201_0603Metric]
C202  1 uF  [C_0201_0603Metric]
C203  1 uF  [C_0201_0603Metric]
C211  1 uF  [C_0201_0603Metric]
L1  DNP  [L_0201_0603Metric]
L2  100 uH  [L_TDK_MLZ2012_h1.25mm]
L3  56 nH  [L_0201_0603Metric]
L6  5.6 nH  [L_0201_0603Metric]
L27  100 uH  [L_TDK_MLZ2012_h1.25mm]
L28  18 nH  [L_0201_0603Metric]
L29  100 uH  [L_TDK_MLZ2012_h1.25mm]
L30  56 nH  [L_0201_0603Metric]
L33  100 uH  [L_TDK_MLZ2012_h1.25mm]
L34  33 nH  [L_0201_0603Metric]
R1  470  [R_0201_0603Metric]
R2  470  [R_0201_0603Metric]
R3  22.6k  [R_0201_0603Metric]
R4  Tolerance: ±1%  [R_0201_0603Metric]  (hidden comment: 51k)
R5  10k  [R_0402_1005Metric]
R43  220  [R_0201_0603Metric]
R120  10k  [R_0402_1005Metric]
R123  10  [R_0201_0603Metric]
R124  220  [R_0201_0603Metric]
R130  220  [R_0201_0603Metric]
R132  470  [R_0201_0603Metric]
R133  1k  [R_0201_0603Metric]
R134  180  [R_0201_0603Metric]
R135  12k  [R_0201_0603Metric]
R136  220  [R_0201_0603Metric]
R137  470  [R_0201_0603Metric]
R138  1k  [R_0201_0603Metric]
R142  33  [R_0201_0603Metric]
R143  100  [R_0201_0603Metric]
R144  1k  [R_0201_0603Metric]
R147  220  [R_0201_0603Metric]
R150  0  [R_0201_0603Metric]
R151  1k  [R_0201_0603Metric]
R155  10  [R_0201_0603Metric]
T1  RF_BALUN  [Anaren_0805_2012Metric-6]
T2  RF_BALUN  [Anaren_0805_2012Metric-6]
U4  RFFC5072  [QFN-32-1EP_5x5mm_P0.5mm_EP3.7x3.7mm_ThermalVias]
U5  FM8625H  [TSLP-6-4_1.1x0.7mm_P0.4mm]
U6  FM8625H  [TSLP-6-4_1.1x0.7mm_P0.4mm]
U38  BGB741L7ESD  [TSLP-7-1]

### Ports
MIX_CLK (in), MIXER{RFFC5072} (bidir), RX_EN (in), RX_MIX_IN (in), RX_MIX_OUT (out), TX_MIX_EN (in), TX_MIX_IN (in), TX_MIX_OUT (out)

### Nets
2V5RF: C7.1 C8.1 U5.4(VDD) U6.4(VDD)
GND: C1.2 C3.2 C5.2 C7.2 C8.2 C9.1 C12.2 C13.2 C16.1 C25.2 C34.2 C35.2 C36.2 C37.2 C41.2 C42.2 C49.1 C70.2 C109.2 C188.2 C190.2 C193.2 C194.2 R4.1 R130.1 R136.1 R143.1 R147.2 R151.2 U4.12(TM) U4.33(EP) U5.2(GND) U6.2(GND) U38.7(GND)
VAA: C1.1 C3.1 C5.1 C41.1 C42.1 C190.1 C193.1 L2.1 L27.1 L29.1 R5.1 R120.1 R132.2 R135.2 U4.5(ANA_VDD1) U4.19(DIG_VDD) U4.22(ANA_VDD2) U38.1(VCC)
MIX_CLK: R150.2 R151.1 ; port MIX_CLK
MIX_IN: C28.2 U6.5(RFIN)
MIX_IN+: L1.1 T1.4(PR2) U4.23(MIX_IPP)
MIX_IN-: L1.2 T1.3(PR1) U4.24(MIX_IPN)
MIX_OUT: C46.1 U5.5(RFIN)
MIX_OUT+: C114.2 L3.2 L6.2 R124.2 T2.3(PR1) U4.28(MIX_OPP)
MIX_OUT-: C114.1 C198.1 L30.2 R43.2 T2.4(PR2) U4.27(MIX_OPN)
MIXER.ENBL: C109.1 U4.1(ENBL/GPO5)
MIXER.LD: U4.26(GPO4/LD/DO)
MIXER.SCLK: C36.1 U4.31(SCLK)
MIXER.SDATA: C37.1 U4.32(SDATA)
MIXER.~{{EN}}: C35.1 U4.30(~{{EN}})
MIXER.~{{RESET}}: C34.1 R5.2 U4.29(~{{RESET}})
REF_IN: C67.2 C70.1 U4.10(REF_IN)
RX_EN: C9.2 C16.2 U5.6(CTRL) U6.6(CTRL) ; port RX_EN
RX_MIX_IN: U6.1(RF2) ; port RX_MIX_IN
RX_MIX_OUT: U5.1(RF2) ; port RX_MIX_OUT
TX_MIX_EN: U38.5(CTRL) ; port TX_MIX_EN
TX_MIX_IN: U6.3(RF1) ; port TX_MIX_IN
TX_MIX_OUT: C189.1 ; port TX_MIX_OUT
NetC12_1: C12.1 R1.2 U4.8(LFILT3)
NetC13_1: C13.1 R1.1 R2.2
NetC14_1: C14.1 C15.1 R2.1 U4.7(LFILT2)
NetC14_2: C14.2 R3.1 U4.6(LFILT1)
NetC15_2: C15.2 R3.2
NetC25_1: C25.1 T1.2(S2)
NetC28_1: C28.1 T1.1(S1)
NetC46_2: C46.2 T2.1(S1)
NetC49_2: C49.2 T2.2(S2)
NetC67_1: C67.1 R150.1
NetC188_1: C188.1 C189.2 R155.2
NetC191_1: C191.1 L27.2 L28.1 R132.1 R133.2
NetC191_2: C191.2 R130.2
NetC192_1: C192.1 L28.2 R133.1 R155.1 U38.4(RFOUT)
NetC192_2: C192.2 R134.2
NetC194_1: C194.1 L33.1 R137.2 U38.2(BIAS)
NetC195_1: C195.1 L33.2 L34.1 R137.1 R138.2
NetC195_2: C195.2 R136.2
NetC198_2: C198.2 R142.2
NetC202_1: C202.1 R147.1
NetC202_2: C202.2 L2.2 L3.1 R124.1 R144.1
NetC203_1: C203.1 L29.2 L30.1 R43.1 R142.1
NetC203_2: C203.2 R143.2
NetC211_1: C211.1 U5.3(RF1)
NetC211_2: C211.2 R123.2
NetL6_1: L6.1 R144.2
NetL34_2: L34.2 R123.1 R134.1 R138.1 U38.3(RFIN)
NetR4_2: R4.2 U4.4(REXT)
NetR120_2: R120.2 U4.9(MODE/GPO6)
NetR135_1: R135.1 U38.6(ADJ)

Not connected (* = marked no-connect by the designer): U4 2(EXT_LO)* 3(EXT_LO_DEC)* 11(NC) 13(NC) 14(NC) 15(GPO1/ADD1)* 16(GPO2/ADD2)* 17(NC) 18(NC) 20(NC) 21(NC) 25(GPO3/FM)*

### Notes on the sheet
- (near R2) loop filter
- 1
- 2
- 3
- 4
- 5
- 6
- A
- B
- C
- ${LICENSE}
- D
- Title: ${TITLE}
- File: mixer.kicad_sch
- Sheet: /
- ${COPYRIGHT}
- KiCad E.D.A.  kicad (5.1.4)-1
- Size: A4
- Date: ${DATE}
- Rev: ${VERSION}
- Id: 1/1

### Library data of the parts
C1 C3 C5 C7 C8 C25 C28 C41 C42 C46 C49 C189-C195 C211 = C: Manufacturer: Murata; Part Number: GRM033R61A105ME44D; Description: CAP CER 1UF 10V X5R 0201; Substitution: GRM033R61A105ME44*, GRM033R61C105ME15*, Samsung CL03A105MO3NRN*; Value: 1 uF; Footprint: Capacitor_SMD:C_0201_0603Metric
C9 C16 = C: Manufacturer: Murata; Part Number: GRM033R71A332KA01D; Description: CAP CER 3300PF 10V X7R 0201; Substitution: GRM033R71A332K*; Value: 3.3 nF; Footprint: Capacitor_SMD:C_0201_0603Metric
C12 C13 = C: Manufacturer: Murata; Part Number: GRM0335C1E331JA01D; Description: CAP CER 330PF 25V C0G/NP0 0201; Substitution: GRM0335C1E331*, GRM0335C1H331*; Value: 330 pF; Footprint: Capacitor_SMD:C_0201_0603Metric
C14 = C: Manufacturer: Murata; Part Number: GRM0335C1H8R2CA01D; Description: CAP CER 8.2PF 50V C0G/NP0 0201; Substitution: GRM0335C1H8R2*; Value: 8.2 pF; Footprint: Capacitor_SMD:C_0201_0603Metric
C15 = C: Manufacturer: Murata; Part Number: GRM0335C1H181JA01D; Description: CAP CER 180PF 50V C0G/NP0 0201; Substitution: GRM0335C1H181*; Value: 180 pF; Footprint: Capacitor_SMD:C_0201_0603Metric
C34-C37 C67 C109 = C: as C125 on sheet power; Value: 33 pF; Footprint: Capacitor_SMD:C_0201_0603Metric
C70 = C: Manufacturer: Murata; Part Number: GRM0335C1E101JA01D; Description: CAP CER 100PF 25V C0G/NP0 0201; Substitution: GRM0335C1E101JA01*, GRM0335C1H101JA01*; Value: 100 pF; Footprint: Capacitor_SMD:C_0201_0603Metric
C114 C188 = C: Manufacturer: Murata; Part Number: GRM0335C1ER30BA01D; Description: CAP CER 0.3PF 25V C0G/NP0 0201; Substitution: GRM0335C1*R30*A01*, GRM0335C2*R30*A01*; Value: 0.3 pF; Footprint: Capacitor_SMD:C_0201_0603Metric
C198 = C: Manufacturer: Murata; Part Number: GRM0335C1ER70WA01D; Description: CAP CER 0.7PF 25V C0G/NP0 0201; Substitution: GRM0335C1HR70W*, GRM0335C1ER70W*; Value: 0.7 pF; Footprint: Capacitor_SMD:C_0201_0603Metric
C202 = C: Manufacturer: Murata; Part Number: GRM033R61A105ME44D; Description: CAP CER 1UF 10V X5R 0201; Substitution: GRM033R71A222KA01*; Value: 1 uF; Footprint: Capacitor_SMD:C_0201_0603Metric
C203 = C: Manufacturer: Murata; Part Number: GRM033R61A105ME44D; Description: CAP CER 1UF 10V X5R 0201; Substitution: GRM0335C1H8R2*; Value: 1 uF; Footprint: Capacitor_SMD:C_0201_0603Metric
L1 = L: Value: DNP; Footprint: Inductor_SMD:L_0201_0603Metric
L2 L27 L29 L33 = L: Manufacturer: TDK; Part Number: MLZ2012N101LT000; Description: FIXED IND 100UH 140MA 3.5OHM SMD; Substitution: MLZ2012N101LTD25; Value: 100 uH; Footprint: praline:L_TDK_MLZ2012_h1.25mm
L3 L30 = L: Manufacturer: Murata; Part Number: LQP03TN56NJ02D; Description: FIXED IND 56NH 100MA 3.9 OHM SMD; Substitution: LQP03TN56NH02D; Value: 56 nH; Footprint: Inductor_SMD:L_0201_0603Metric
L6 = L: Manufacturer: Murata; Part Number: LQP03TN5N6H02D; Description: FIXED IND 5.6NH 350MA 400MOHM 0201; Value: 5.6 nH; Footprint: Inductor_SMD:L_0201_0603Metric
L28 = L: Manufacturer: Murata; Part Number: LQP03TN18NJ02D; Description: FIXED IND 18NH 200MA 800MOHM SMD; Substitution: LQP03TN56NH02D; Value: 18 nH; Footprint: Inductor_SMD:L_0201_0603Metric
L34 = L: Manufacturer: Murata; Part Number: LQP03TN33NJ02D; Description: FIXED IND 33NH 120MA 2.95OHM SMD; Substitution: LQP03TN56NH02D; Value: 33 nH; Footprint: Inductor_SMD:L_0201_0603Metric
R1 R2 R132 R137 = R: Manufacturer: Yageo; Part Number: RC0201JR-07470RL; Description: RES 470 OHM 5% 1/20W 0201; Substitution: any equivalent; Value: 470; Footprint: Resistor_SMD:R_0201_0603Metric
R3 = R: as R11 on sheet power; Value: 22.6k; Footprint: Resistor_SMD:R_0201_0603Metric
R4 = R: Manufacturer: Yageo; Part Number: RC0201FR-0751KL; Description: RES 51K OHM 1% 1/20W 0201; Substitution: any equivalent; Value: 51k; Footprint: Resistor_SMD:R_0201_0603Metric
R5 R120 = R: as R52 on sheet power; Value: 10k; Footprint: Resistor_SMD:R_0402_1005Metric
R43 R124 R130 R136 R147 = R: Manufacturer: Yageo; Part Number: RC0201JR-07220RL; Description: RES 220 OHM 5% 1/20W 0201; Substitution: any equivalent; Value: 220; Footprint: Resistor_SMD:R_0201_0603Metric
R123 R155 = R: Manufacturer: Yageo; Part Number: RC0201JR-0710RL; Description: RES 10 OHM 5% 1/20W 0201; Substitution: any equivalent; Value: 10; Footprint: Resistor_SMD:R_0201_0603Metric
R133 R138 R144 R151 = R: Manufacturer: Yageo; Part Number: RC0201FR-071KL; Description: RES 1K OHM 1% 1/20W 0201; Substitution: any equivalent; Value: 1k; Footprint: Resistor_SMD:R_0201_0603Metric
R134 = R: Manufacturer: Yageo; Part Number: RC0201JR-07180RL; Description: RES 180 OHM 5% 1/20W 0201; Substitution: any equivalent; Value: 180; Footprint: Resistor_SMD:R_0201_0603Metric
R135 = R: Part Number: RC0201FR-0712KL; Manufacturer: Yageo; Description: RES 12K OHM 1% 1/20W 0201; Substitution: any equivalent; Value: 12k; Footprint: Resistor_SMD:R_0201_0603Metric
R142 = R: Manufacturer: Yageo; Part Number: RC0201JR-0733RL; Description: RES 33 OHM 5% 1/20W 0201; Substitution: any equivalent; Value: 33; Footprint: Resistor_SMD:R_0201_0603Metric
R143 = R: Manufacturer: Yageo; Part Number: RC0201JR-07100RL; Description: RES 100 OHM 5% 1/20W 0201; Substitution: any equivalent; Value: 100; Footprint: Resistor_SMD:R_0201_0603Metric
R150 = R: Manufacturer: Yageo; Part Number: RC0201JR-070RL; Description: RES 0 OHM JUMPER 1/20W 0201; Substitution: any equivalent; Value: 0; Footprint: Resistor_SMD:R_0201_0603Metric
T1 T2 = BALUN-B0310J50100AHF: Manufacturer: TTM; Description: Ultra Low Profile 0805 Balun 50 to 100 ohm Balanced; Part Number: B0310J50100AHF; Value: RF_BALUN; Footprint: RF_Converter:Anaren_0805_2012Metric-6
U4 = RFFC5072: Manufacturer: RFMD; Part Number: RFFC5072TR7; Description: WIDEBAND SYNTHESIZER/VCO WITH INTEGRATED 6GHz MIXER; Substitution: RFFC5072*; Value: RFFC5072; Footprint: praline:QFN-32-1EP_5x5mm_P0.5mm_EP3.7x3.7mm_ThermalVias
U5 U6 = BGS12P2L6: Manufacturer: Shenzhen Fuman; Description: SPDT RF SWITCH; Part Number: FM8625H; Value: FM8625H; Footprint: praline:TSLP-6-4_1.1x0.7mm_P0.4mm
U38 = BGB741L7ESD: Manufacturer: Infineon; Part Number: BGB741L7ESDE6327XTSA1; Description: IC AMP CELL 50MHZ-3.5GHZ TSLP7-1; Value: BGB741L7ESD; Footprint: praline:TSLP-7-1

## Sheet clock.SchDoc
size 297 x 209 mm
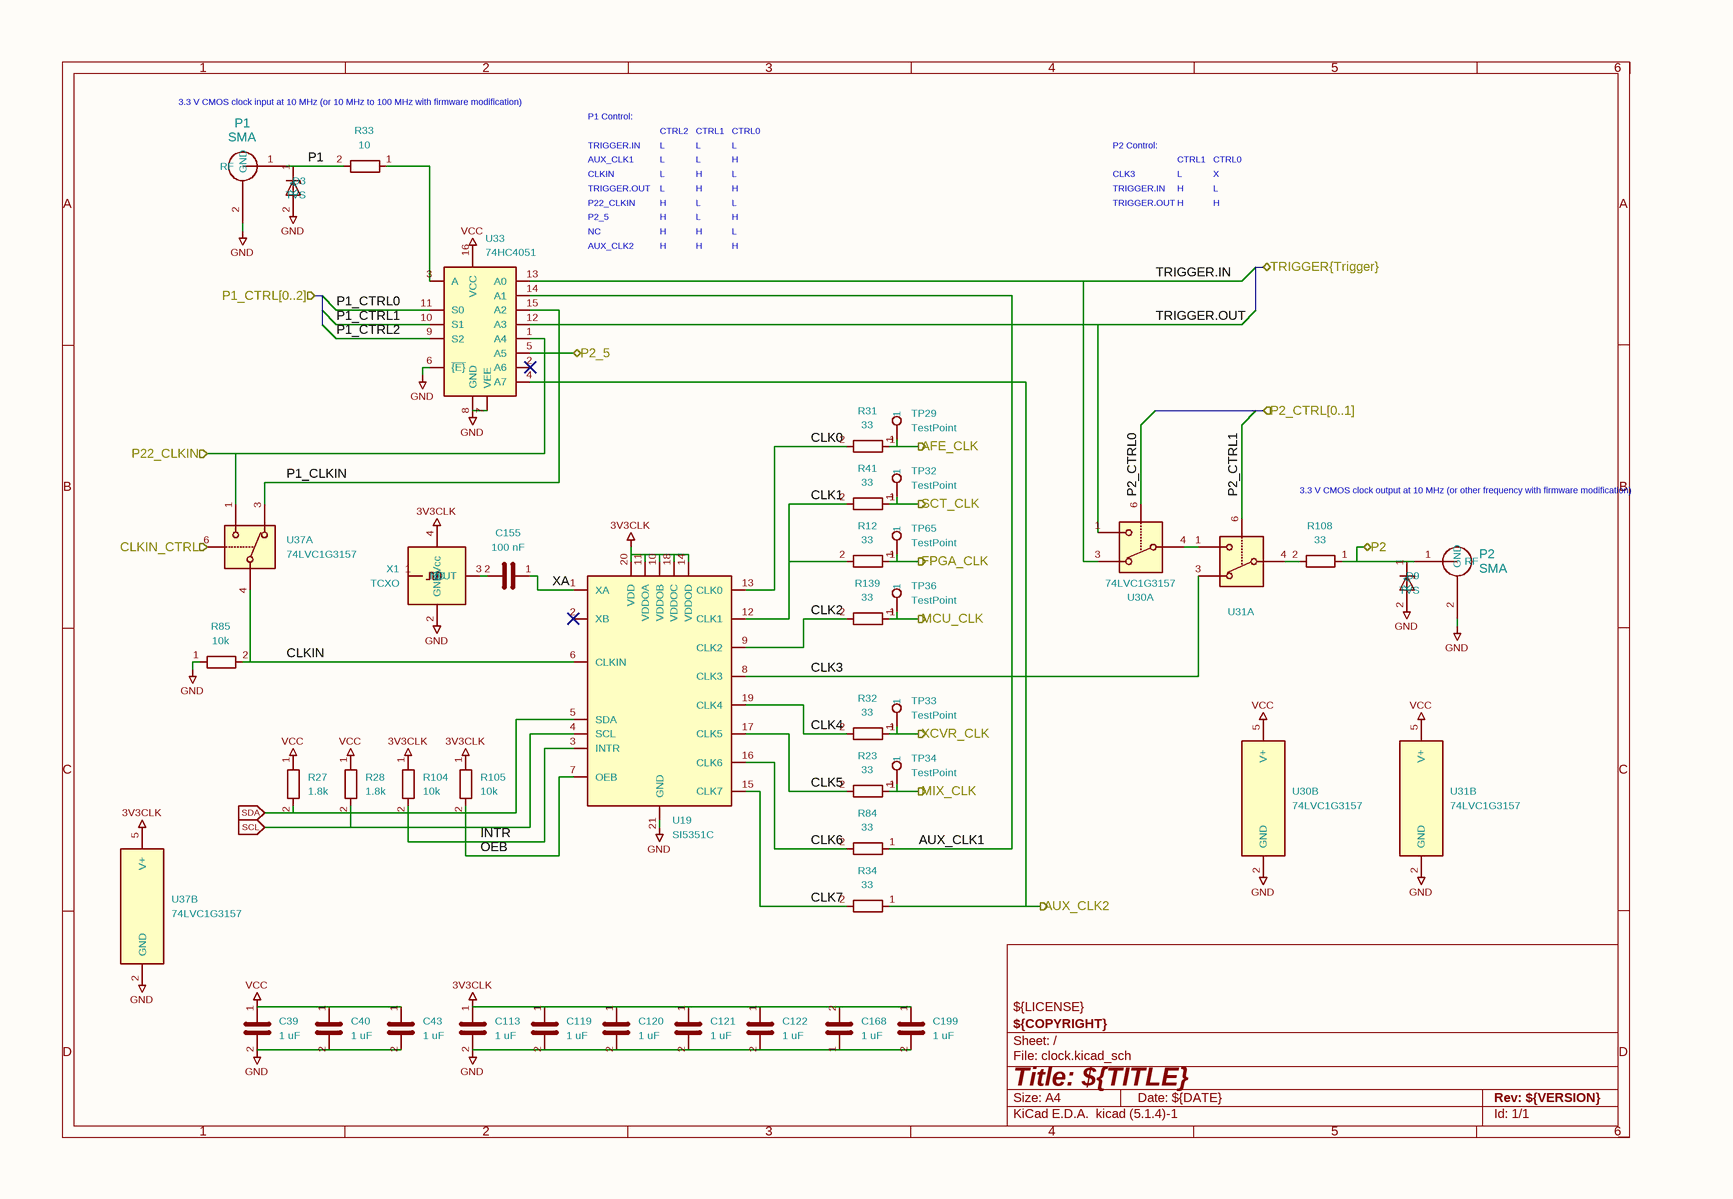
[diagram p9: clock.SchDoc]

### Parts
C39  1 uF  [C_0402_1005Metric]
C40  1 uF  [C_0402_1005Metric]
C43  1 uF  [C_0402_1005Metric]
C113  1 uF  [C_0402_1005Metric]
C119  1 uF  [C_0402_1005Metric]
C120  1 uF  [C_0402_1005Metric]
C121  1 uF  [C_0402_1005Metric]
C122  1 uF  [C_0402_1005Metric]
C155  100 nF  [C_0402_1005Metric]
C168  1 uF  [C_0402_1005Metric]
C199  1 uF  [C_0402_1005Metric]
D3  TVS  [TSLP-2-19]
D9  TVS  [TSLP-2-19]
P1  SMA  [SMA_MyAntenna_A-SMA-KE-16.5A_EdgeMount]
P2  SMA  [SMA_MyAntenna_A-SMA-KE-16.5A_EdgeMount]
R12  33  [R_0201_0603Metric]
R23  33  [R_0201_0603Metric]
R27  1.8k  [R_0402_1005Metric]
R28  1.8k  [R_0402_1005Metric]
R31  33  [R_0201_0603Metric]
R32  33  [R_0201_0603Metric]
R33  10  [R_0201_0603Metric]
R34  33  [R_0201_0603Metric]
R41  33  [R_0201_0603Metric]
R84  33  [R_0201_0603Metric]
R85  10k  [R_0402_1005Metric]
R104  10k  [R_0402_1005Metric]
R105  10k  [R_0402_1005Metric]
R108  33  [R_0201_0603Metric]
R139  33  [R_0201_0603Metric]
TP29  TestPoint  [TestPoint_Pad_D1.0mm]
TP32  TestPoint  [TestPoint_Pad_D1.0mm]
TP33  TestPoint  [TestPoint_Pad_D1.0mm]
TP34  TestPoint  [TestPoint_Pad_D1.0mm]
TP36  TestPoint  [TestPoint_Pad_D1.0mm]
TP65  TestPoint  [TestPoint_Pad_D1.0mm]
U19  SI5351C  [QFN-20-1EP_4x4mm_P0.5mm_EP2.7x2.7mm_ThermalVias]
U30  74LVC1G3157  [SOT-363_SC-70-6]  (parts A,B of 2)
U31  74LVC1G3157  [SOT-363_SC-70-6]  (value not drawn)  (parts A,B of 2)
U33  74HC4051  [DHVQFN-16-1EP_2.5x3.5mm_P0.5mm_EP1x2mm]
U37  74LVC1G3157  [SOT-363_SC-70-6]  (parts A,B of 2)
X1  TCXO  [Oscillator_SMD_SeikoEpson_TG2520SMN-xxx-xxxxxx-4Pin_2.5x2.0mm]

### Ports
AFE_CLK (out), AUX_CLK2 (out), CLKIN_CTRL (in), FPGA_CLK (out), MCU_CLK (out), MIX_CLK (out), P1_CTRL[0..2] (in), P2 (bidir), P2_5 (bidir), P2_CTRL[0..1] (in), P22_CLKIN (in), SCL (in), SCT_CLK (out), SDA (in), TRIGGER{Trigger} (bidir), XCVR_CLK (out)

### Nets
3V3CLK: C113.1 C119.1 C120.1 C121.1 C122.1 C168.2 C199.1 R104.1 R105.1 U19.10(VDDOB) U19.11(VDDOA) U19.14(VDDOD) U19.18(VDDOC) U19.20(VDD) U37.5(V+) X1.4(Vcc)
GND: C39.2 C40.2 C43.2 C113.2 C119.2 C120.2 C121.2 C122.2 C168.1 C199.2 D3.2(A) D9.2(A) P1.2(GND) P2.2(GND) R85.1 U19.21(GND) U30.2(GND) U31.2(GND) U33.6(~{{E}}) U33.7(VEE) U33.8(GND) U37.2(GND) X1.2(GND)
VCC: C39.1 C40.1 C43.1 R27.1 R28.1 U30.5(V+) U31.5(V+) U33.16(VCC)
AFE_CLK: R31.1 TP29.1 ; port AFE_CLK
AUX_CLK1: R84.1 U33.14(A1)
AUX_CLK2: R34.1 U33.4(A7) ; port AUX_CLK2
CLK0: R31.2 U19.13(CLK0)
CLK1: R12.2 R41.2 U19.12(CLK1)
CLK2: R139.2 U19.9(CLK2)
CLK3: U19.8(CLK3) U31.3
CLK4: R32.2 U19.19(CLK4)
CLK5: R23.2 U19.17(CLK5)
CLK6: R84.2 U19.16(CLK6)
CLK7: R34.2 U19.15(CLK7)
CLKIN: R85.2 U19.6(CLKIN) U37.4
CLKIN_CTRL: U37.6 ; port CLKIN_CTRL
FPGA_CLK: R12.1 TP65.1 ; port FPGA_CLK
INTR: R104.2 U19.3(INTR)
MCU_CLK: R139.1 TP36.1 ; port MCU_CLK
MIX_CLK: R23.1 TP34.1 ; port MIX_CLK
OEB: R105.2 U19.7(OEB)
P1: D3.1(K) P1.1(RF) R33.2
P1_CLKIN: U33.15(A2) U37.3
P1_CTRL0: U33.11(S0)
P1_CTRL1: U33.10(S1)
P1_CTRL2: U33.9(S2)
P2: D9.1(K) P2.1(RF) R108.1 ; port P2
P2_5: U33.5(A5) ; port P2_5
P2_CTRL0: U30.6
P2_CTRL1: U31.6
P22_CLKIN: U33.1(A4) U37.1 ; port P22_CLKIN
SCL: R28.2 U19.4(SCL) ; port SCL
SCT_CLK: R41.1 TP32.1 ; port SCT_CLK
SDA: R27.2 U19.5(SDA) ; port SDA
TRIGGER.IN: U30.3 U33.13(A0)
TRIGGER.OUT: U30.1 U33.12(A3)
XA: C155.1 U19.1(XA)
XCVR_CLK: R32.1 TP33.1 ; port XCVR_CLK
NetC155_2: C155.2 X1.3(OUT)
NetR33_1: R33.1 U33.3(A)
NetR108_2: R108.2 U31.4
NetU30_4: U30.4 U31.1

Not connected (* = marked no-connect by the designer): U19 2(XB)*; U33 2(A6)*; X1 1(NC)

### Notes on the sheet
- 3.3 V CMOS clock input at 10 MHz
  (or 10 MHz to 100 MHz with firmware modification)
- P1 Control:
- CTRL2
- CTRL1
- CTRL0
- TRIGGER.OUT
- P2_5
- TRIGGER.IN
- AUX_CLK1
- P22_CLKIN
- CLKIN
- L
- H
- CLK3
- P2 Control:
- X
- NC
- AUX_CLK2
- 3.3 V CMOS clock output at 10 MHz
  (or other frequency with firmware modification)
- 1
- 2
- 3
- 4
- 5
- 6
- A
- B
- C
- ${LICENSE}
- D
- Title: ${TITLE}
- File: clock.kicad_sch
- Sheet: /
- ${COPYRIGHT}
- KiCad E.D.A.  kicad (5.1.4)-1
- Size: A4
- Date: ${DATE}
- Rev: ${VERSION}
- Id: 1/1

### Library data of the parts
C39 C40 C43 C113 C119-C122 C168 C199 = C: as C32 on sheet power; Value: 1 uF; Footprint: Capacitor_SMD:C_0402_1005Metric
C155 = C: as C153 on sheet power; Value: 100 nF; Footprint: Capacitor_SMD:C_0402_1005Metric
D3 D9 = D_Zener: Manufacturer: Slkor; Part Number: SLESD0301L; Description: TVS DIODE 3.3V UNIDIRECTIONAL DFN1006; Value: TVS; Footprint: praline:TSLP-2-19
P1 P2 = GSG-RF-CONN: Manufacturer: MyAntenna; Part Number: A-SMA-KE-16.5A; Description: CONN SMA RCPT STR 50OHM EDGE MNT; Substitution: M04-0102170R0A; Value: SMA; Footprint: praline:SMA_MyAntenna_A-SMA-KE-16.5A_EdgeMount
R12 R23 R31 R32 R34 R41 R84 R108 R139 = R: as R142 on sheet mixer; Value: 33; Footprint: Resistor_SMD:R_0201_0603Metric
R27 R28 = R: as R53 on sheet power; Value: 1.8k; Footprint: Resistor_SMD:R_0402_1005Metric
R33 = R: as R123 on sheet mixer; Value: 10; Footprint: Resistor_SMD:R_0201_0603Metric
R85 R104 R105 = R: as R52 on sheet power; Value: 10k; Footprint: Resistor_SMD:R_0402_1005Metric
U19 = Si5351C-B-GM: Manufacturer: Silicon Laboratories Inc; Description: IC CLK GENERATOR 160MHZ 20QFN; Substitution: SI5351C-B-GM*; Part Number: SI5351C-B-GM; Value: SI5351C; Footprint: praline:QFN-20-1EP_4x4mm_P0.5mm_EP2.7x2.7mm_ThermalVias
U30 U31 U37 = NC7SB3157P6X: Manufacturer: UMW; Part Number: ET3157; Description: IC SW SPDT-NO/NCX1 7OHM SC70-6; Substitution: SN74LVC1G3157DCKR, TI SN74LVC1G3157DCKR; Value: 74LVC1G3157; Footprint: Package_TO_SOT_SMD:SOT-363_SC-70-6
U33 = 74HC4051: Manufacturer: Nexperia; Part Number: 74HC4051BQ,115; Description: IC MUX 8:1 120OHM 16DHVQFN; Value: 74HC4051; Footprint: Package_DFN_QFN:DHVQFN-16-1EP_2.5x3.5mm_P0.5mm_EP1x2mm
X1 = TG2520SMN-xx.xxxxxxMhz-xxxxNM: Manufacturer: HCI; Part Number: 8122S-25.000NQ33FTL; Description: 25 MHz TCXO; Value: TCXO; Footprint: praline:Oscillator_SMD_SeikoEpson_TG2520SMN-xxx-xxxxxx-4Pin_2.5x2.0mm
TP29 TP32-TP34 TP36 TP65 = TestPoint: Value: TestPoint; Footprint: TestPoint:TestPoint_Pad_D1.0mm

## Sheet switch_control.SchDoc
size 297 x 209 mm
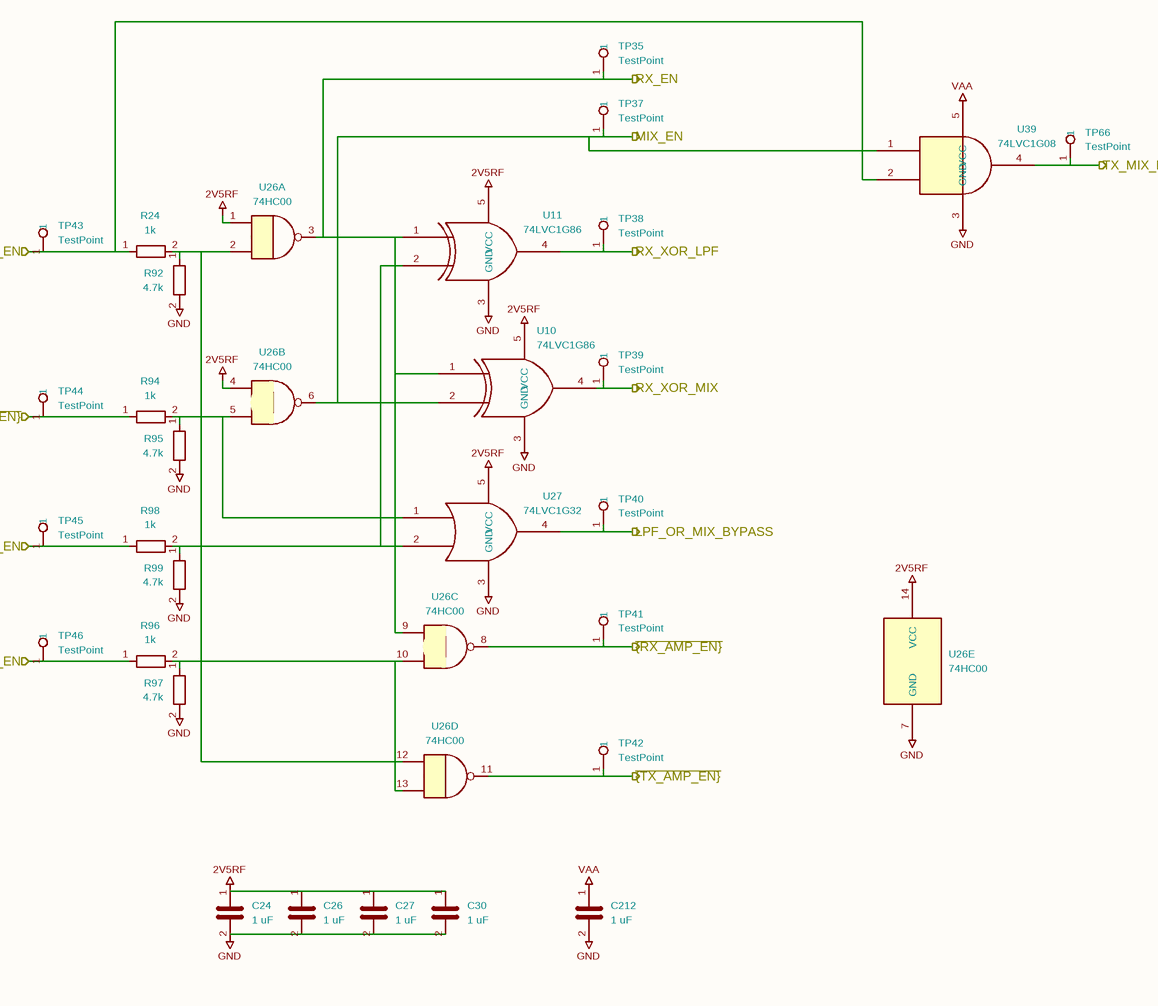
[diagram p10: switch_control.SchDoc]

### Parts
C24  1 uF  [C_0201_0603Metric]
C26  1 uF  [C_0201_0603Metric]
C27  1 uF  [C_0201_0603Metric]
C30  1 uF  [C_0201_0603Metric]
C212  1 uF  [C_0201_0603Metric]
R24  1k  [R_0201_0603Metric]
R92  4.7k  [R_0201_0603Metric]
R94  1k  [R_0201_0603Metric]
R95  4.7k  [R_0201_0603Metric]
R96  1k  [R_0201_0603Metric]
R97  4.7k  [R_0201_0603Metric]
R98  1k  [R_0201_0603Metric]
R99  4.7k  [R_0201_0603Metric]
TP35  TestPoint  [TestPoint_Pad_D1.0mm]
TP37  TestPoint  [TestPoint_Pad_D1.0mm]
TP38  TestPoint  [TestPoint_Pad_D1.0mm]
TP39  TestPoint  [TestPoint_Pad_D1.0mm]
TP40  TestPoint  [TestPoint_Pad_D1.0mm]
TP41  TestPoint  [TestPoint_Pad_D1.0mm]
TP42  TestPoint  [TestPoint_Pad_D1.0mm]
TP43  TestPoint  [TestPoint_Pad_D1.0mm]
TP44  TestPoint  [TestPoint_Pad_D1.0mm]
TP45  TestPoint  [TestPoint_Pad_D1.0mm]
TP46  TestPoint  [TestPoint_Pad_D1.0mm]
TP66  TestPoint  [TestPoint_Pad_D1.0mm]
U10  74LVC1G86  [SOT-353_SC-70-5]
U11  74LVC1G86  [SOT-353_SC-70-5]
U26  74HC00  [DHVQFN-14-1EP_2.5x3mm_P0.5mm_EP1x1.5mm]  (parts A,B,C,D,E of 5)
U27  74LVC1G32  [SOT-353_SC-70-5]
U39  74LVC1G08  [SOT-353_SC-70-5]

### Ports
LPF_EN (in), LPF_OR_MIX_BYPASS (out), MIX_EN (out), RF_AMP_EN (in), RX_EN (out), RX_XOR_LPF (out), RX_XOR_MIX (out), TX_EN (in), TX_MIX_EN (out), ~{{MIX_EN}} (in), ~{{RX_AMP_EN}} (out), ~{{TX_AMP_EN}} (out)

### Nets
2V5RF: C24.1 C26.1 C27.1 C30.1 U10.5(VCC) U11.5(VCC) U26.1 U26.4 U26.14(VCC) U27.5(VCC)
GND: C24.2 C26.2 C27.2 C30.2 C212.2 R92.2 R95.2 R97.2 R99.2 U10.3(GND) U11.3(GND) U26.7(GND) U27.3(GND) U39.3(GND)
VAA: C212.1 U39.5(VCC)
LPF_EN: R98.1 TP45.1 ; port LPF_EN
LPF_OR_MIX_BYPASS: TP40.1 U27.4 ; port LPF_OR_MIX_BYPASS
MIX_EN: TP37.1 U10.2 U26.6 U39.1 ; port MIX_EN
RF_AMP_EN: R96.1 TP46.1 ; port RF_AMP_EN
RX_EN: TP35.1 U10.1 U11.1 U26.3 U26.9 ; port RX_EN
RX_XOR_LPF: TP38.1 U11.4 ; port RX_XOR_LPF
RX_XOR_MIX: TP39.1 U10.4 ; port RX_XOR_MIX
TX_EN: R24.1 TP43.1 U39.2 ; port TX_EN
TX_MIX_EN: TP66.1 U39.4 ; port TX_MIX_EN
~{{MIX_EN}}: R94.1 TP44.1 ; port ~{{MIX_EN}}
~{{RX_AMP_EN}}: TP41.1 U26.8 ; port ~{{RX_AMP_EN}}
~{{TX_AMP_EN}}: TP42.1 U26.11 ; port ~{{TX_AMP_EN}}
NetR24_2: R24.2 R92.1 U26.2 U26.12
NetR94_2: R94.2 R95.1 U26.5 U27.1
NetR96_2: R96.2 R97.1 U26.10 U26.13
NetR98_2: R98.2 R99.1 U11.2 U27.2

### Notes on the sheet
- 1
- 2
- 3
- 4
- 5
- 6
- A
- B
- C
- ${LICENSE}
- D
- Title: ${TITLE}
- File: switch_control.kicad_sch
- Sheet: /
- ${COPYRIGHT}
- KiCad E.D.A.  kicad (5.1.4)-1
- Size: A4
- Date: ${DATE}
- Rev: ${VERSION}
- Id: 1/1

### Library data of the parts
C24 C26 C27 C30 C212 = C: as C1 on sheet mixer; Value: 1 uF; Footprint: Capacitor_SMD:C_0201_0603Metric
R24 R94 R96 R98 = R: as R133 on sheet mixer; Value: 1k; Footprint: Resistor_SMD:R_0201_0603Metric
R92 R95 R97 R99 = R: as R51 on sheet power; Value: 4.7k; Footprint: Resistor_SMD:R_0201_0603Metric
U10 U11 = 74LVC1G86: Manufacturer: UMW; Part Number: SN74LVC1G86DCKR; Description: IC GATE XOR 1CH 2-INP SC70-5; Substitution: TI SN74LVC1G86DCKR; Value: 74LVC1G86; Footprint: Package_TO_SOT_SMD:SOT-353_SC-70-5
U26 = 74HC00: Manufacturer: Nexperia; Part Number: 74HC00BQ,115; Description: IC GATE NAND 4CH 2-INP 14DHVQFN; Value: 74HC00; Footprint: Package_DFN_QFN:DHVQFN-14-1EP_2.5x3mm_P0.5mm_EP1x1.5mm
U27 = 74LVC1G32: Manufacturer: UMW; Part Number: SN74LVC1G32DCKR; Description: IC GATE OR 1CH 2-INP SC70-5; Substitution: TI SN74LVC1G32DCKR; Value: 74LVC1G32; Footprint: Package_TO_SOT_SMD:SOT-353_SC-70-5
U39 = 74LVC1G08: Manufacturer: UMW; Part Number: SN74LVC1G08DCKR; Description: IC GATE AND 1CH 2-INP SC70-5; Substitution: TI SN74LVC1G08DCKR; Value: 74LVC1G08; Footprint: Package_TO_SOT_SMD:SOT-353_SC-70-5
TP35 TP37-TP46 TP66 = TestPoint: Value: TestPoint; Footprint: TestPoint:TestPoint_Pad_D1.0mm